# EAGLE design lc3dimmer_common_gnd (EAGLE 5.04)
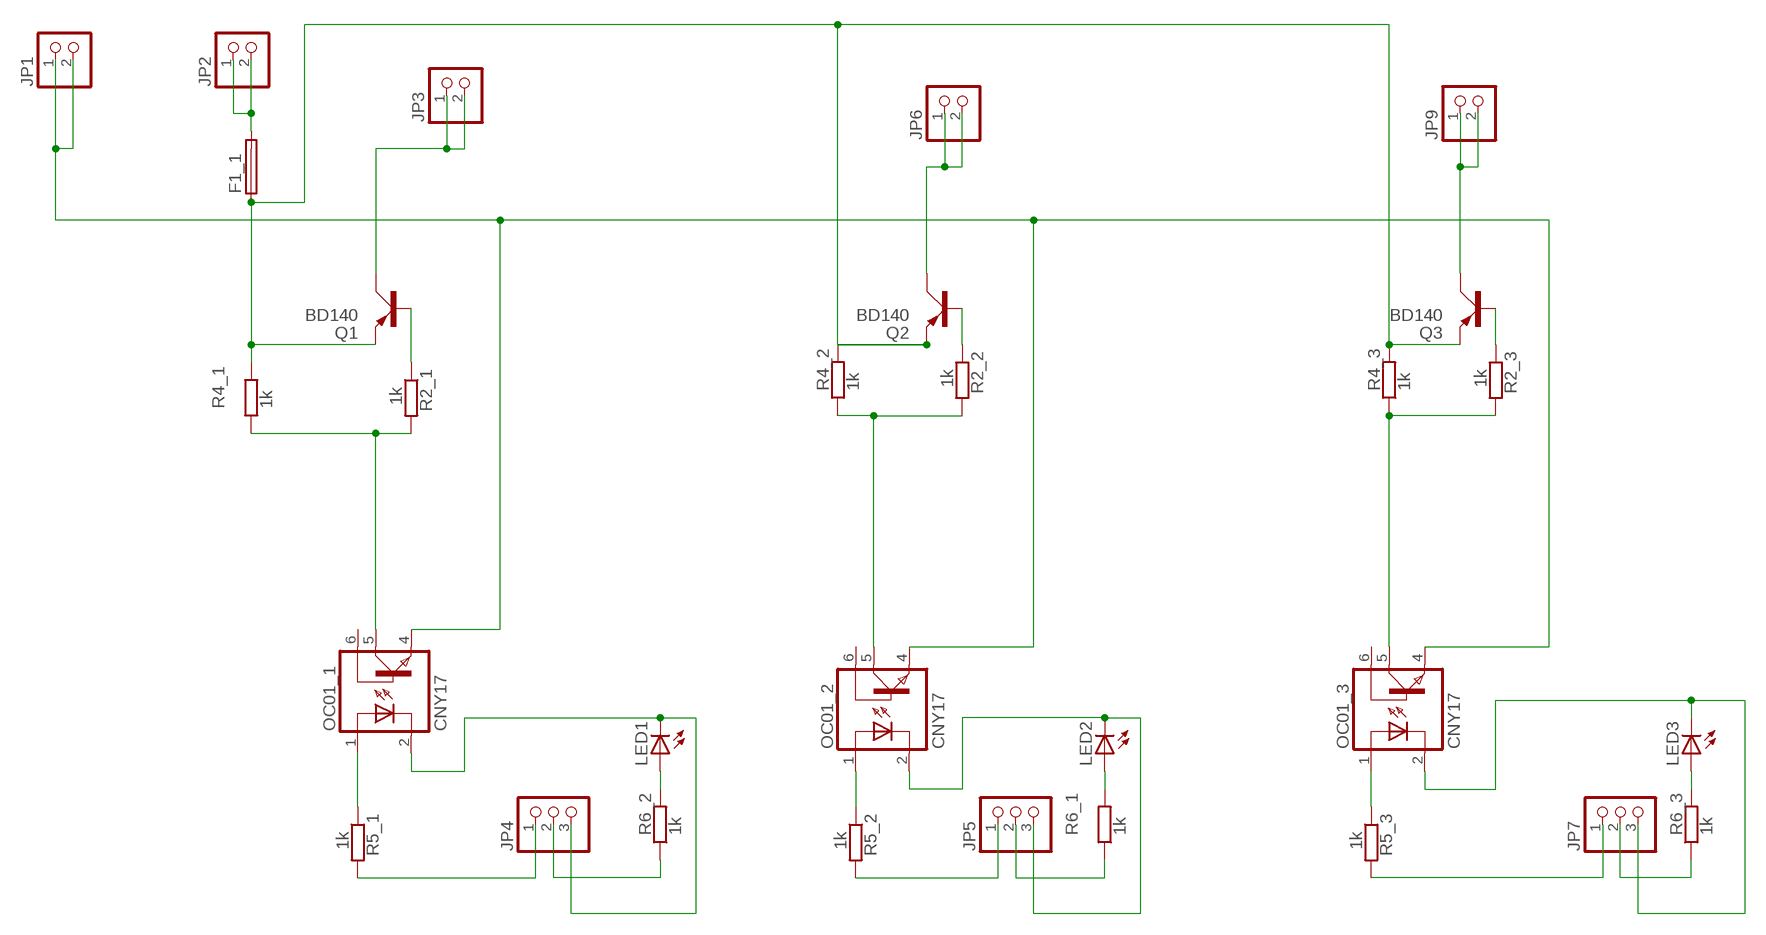
[diagram p0: schematic, sheet 1]

## Parts
F1_1  F457REICHELT  [PTF50]
JP1  PINHD-1X2  [1X02]
JP2  PINHD-1X2  [1X02]
JP3  PINHD-1X2  [1X02]
JP4  PINHD-1X3  [1X03]
JP5  PINHD-1X3  [1X03]
JP6  PINHD-1X2  [1X02]
JP7  PINHD-1X3  [1X03]
JP9  PINHD-1X2  [1X02]
LED1  LED3MM  [LED3MM]
LED2  LED3MM  [LED3MM]
LED3  LED3MM  [LED3MM]
OC01_1  CNY17  [DIL06]
OC01_2  CNY17  [DIL06]
OC01_3  CNY17  [DIL06]
Q1  BD140  [TO126AV]
Q2  BD140  [TO126AV]
Q3  BD140  [TO126AV]
R2_1  1k  R-EU_0207/10  [0207/10]
R2_2  1k  R-EU_0207/10  [0207/10]
R2_3  1k  R-EU_0207/10  [0207/10]
R4_1  1k  R-EU_0207/10  [0207/10]
R4_2  1k  R-EU_0207/10  [0207/10]
R4_3  1k  R-EU_0207/10  [0207/10]
R5_1  1k  R-EU_R1206  [R1206]
R5_2  1k  R-EU_R1206  [R1206]
R5_3  1k  R-EU_R1206  [R1206]
R6_1  1k  R-EU_R1206  [R1206]
R6_2  1k  R-EU_R1206  [R1206]
R6_3  1k  R-EU_R1206  [R1206]

## Nets
12V+: F1_1.2 JP2.1 JP2.2
DIMMGND: JP3.1 JP3.2 Q1.C
GND: JP7.3 LED3.K(C) OC01_3.2(C)
LED+: F1_1.1 Q1.E Q2.E Q3.E R4_1.2 R4_2.2 R4_3.2
LED-: JP1.1 JP1.2 OC01_1.4(EMI) OC01_2.4(EMI) OC01_3.4(EMI)
N$2: OC01_2.5(COL) R2_2.2 R4_2.1
N$3: OC01_1.5(COL) R2_1.2 R4_1.1
N$4: OC01_2.1(A) R5_2.1
N$5: Q1.B R2_1.1
N$6: Q2.B R2_2.1
N$7: OC01_3.5(COL) R2_3.2 R4_3.1
N$8: Q3.B R2_3.1
N$12: JP6.1 JP6.2 Q2.C
N$14: OC01_3.1(A) R5_3.1
N$23: JP9.1 JP9.2 Q3.C
N$24: LED1.A R6_2.2
N$25: LED2.A R6_1.2
N$26: JP4.2 R6_2.1
N$27: LED3.A R6_3.2
N$28: JP4.1 R5_1.2
N$29: JP5.1 R5_2.2
N$30: JP7.2 R6_3.1
N$31: JP5.3 LED2.K(C) OC01_2.2(C)
N$32: JP5.2 R6_1.1
N$33: JP7.1 R5_3.2
N$34: JP4.3 LED1.K(C) OC01_1.2(C)
N$37: OC01_1.1(A) R5_1.1
Unconnected: OC01_1.6(BAS) OC01_2.6(BAS) OC01_3.6(BAS)

## Library data of the parts
F1_1 = fuse:F457: FUSE HOLDER CS, Schukat
JP1-JP3 JP6 JP9 = pinhead:PINHD-1X2: PIN HEADER
JP4 JP5 JP7 = pinhead:PINHD-1X3: PIN HEADER
LED1-LED3 = led:LED: LED OSRAM: - CHIPLED LG R971, LG N971, LY N971, LG Q971, LY Q971, LO R971, LY R971 LH N974, LH R974 LS Q976, LO Q976, LY Q976 LO Q996 - Hyper CHIPLED LW Q18S LB Q993, LB Q99A, LB R99A - SideLED LS A670, LO A670, LY A670, LG A670, LP A670 LB A673, LV A673, LT A673, LW A673 LH A674 LY A675 LS A676, LA A676, LO A676, LY A676, LW A676 LS A679, LY A679, LG A679 - Hyper Micro SIDELED® LS Y876, LA Y876, LO Y876, LY Y876 LT Y87S - SmartLED LW L88C, LW L88S LB L89C, LB L89S, LG L890 LS L89K, LO L89K, LY L89K LS L896, LA L896, LO L896, LY L896 - TOPLED LS T670, LO T670, LY T670, LG T670, LP T670 LSG T670, LSP T670, LSY T670, LOP T670, LYG T670 LG T671, LOG T671, LSG T671 LB T673, LV T673, LT T673, LW T673 LH T674 LS T676, LA T676, LO T676, LY T676, LB T676, LH T676, LSB T676, LW T676 LB T67C, LV T67C, LT T67C, LS T67K, LO T67K, LY T67K, LW E67C LS E67B, LA E67B, LO E67B, LY E67B, LB E67C, LV E67C, LT E67C LW T67C LS T679, LY T679, LG T679 LS T770, LO T770, LY T770, LG T770, LP T770 LB T773, LV T773, LT T773, LW T773 LH T774 LS E675, LA E675, LY E675, LS T675 LS T776, LA T776, LO T776, LY T776, LB T776 LHGB T686 LT T68C, LB T68C - Hyper Mini TOPLED® LB M676 - Mini TOPLED Santana® LG M470 LS M47K, LO M47K, LY M47K Source: http://www.osram.convergy.de - LUMILED® LXK2-PW12-R00, LXK2-PW12-S00, LXK2-PW14-U00, LXK2-PW14-V00 LXK2-PM12-R00, LXK2-PM12-S00, LXK2-PM14-U00 LXK2-PE12-Q00, LXK2-PE12-R00, LXK2-PE12-S00, LXK2-PE14-T00, LXK2-PE14-U00 LXK2-PB12-K00, LXK2-PB12-L00, LXK2-PB12-M00, LXK2-PB14-N00, LXK2-PB14-P00, LXK2-PB14-Q00 LXK2-PR12-L00, LXK2-PR12-M00, LXK2-PR14-Q00, LXK2-PR14-R00 LXK2-PD12-Q00, LXK2-PD12-R00, LXK2-PD12-S00 LXK2-PH12-R00, LXK2-PH12-S00 LXK2-PL12-P00, LXK2-PL12-Q00, LXK2-PL12-R00 Source: www.luxeon.com
OC01_1-OC01_3 = optocoupler:CNY17: SIEMENS OPTO COUPLER
Q1-Q3 = transistor-power:BD140: PNP TRANSISTOR
R2_1-R2_3 R4_1-R4_3 R5_1-R5_3 R6_1-R6_3 = rcl:R-EU_: RESISTOR, European symbol

## Board
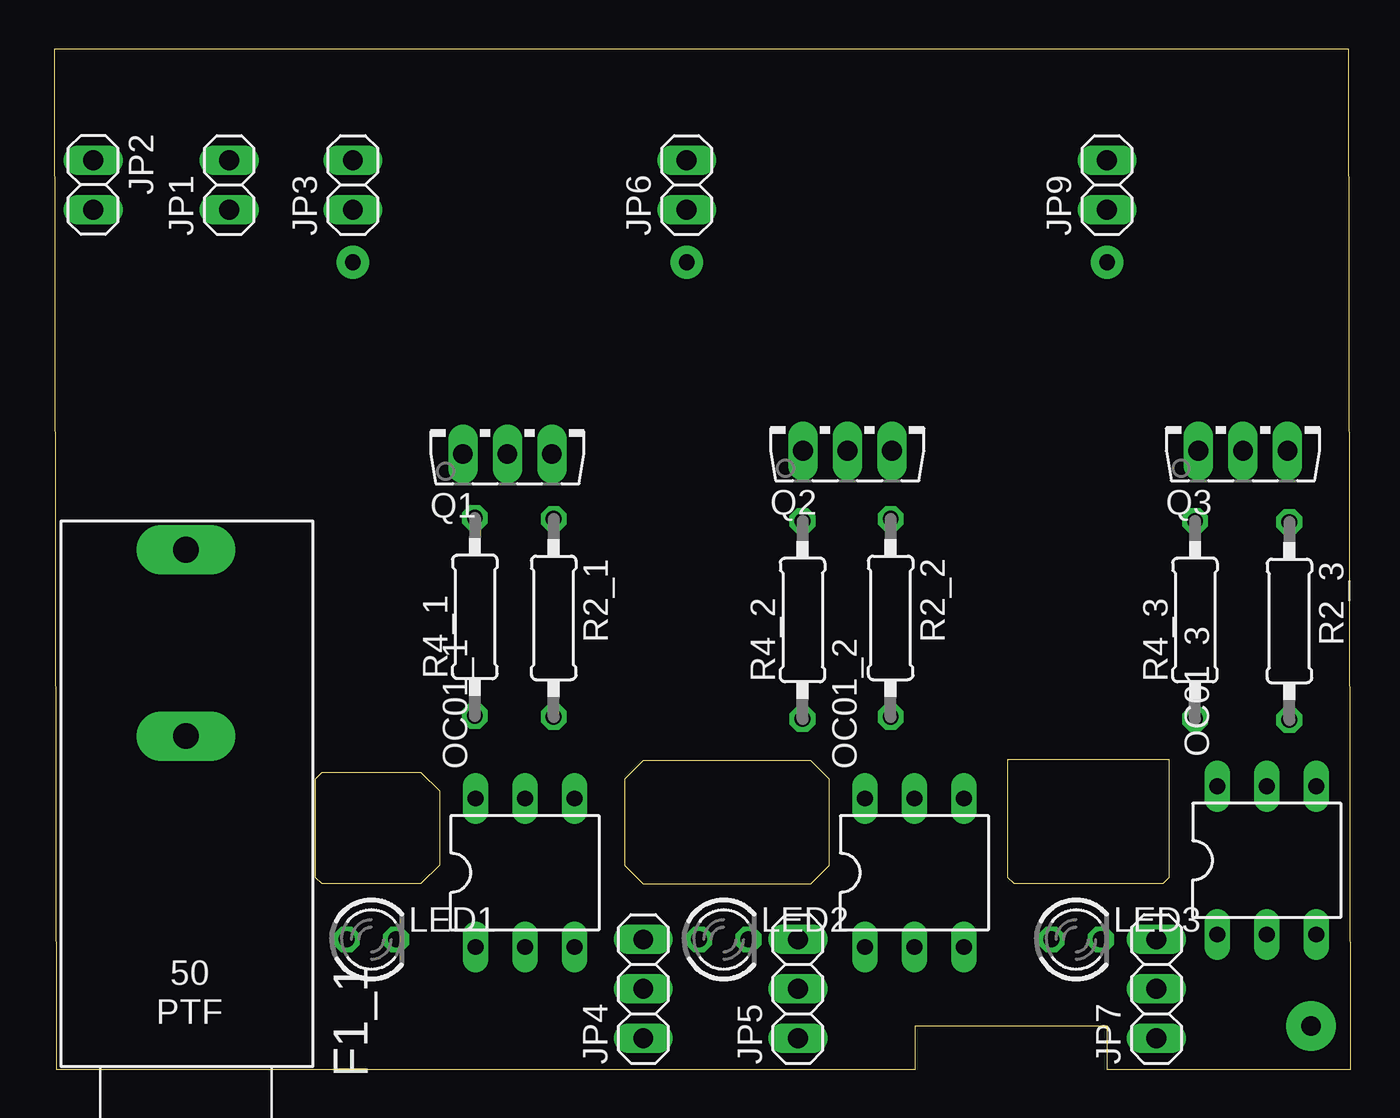
[diagram p1: board, top side]
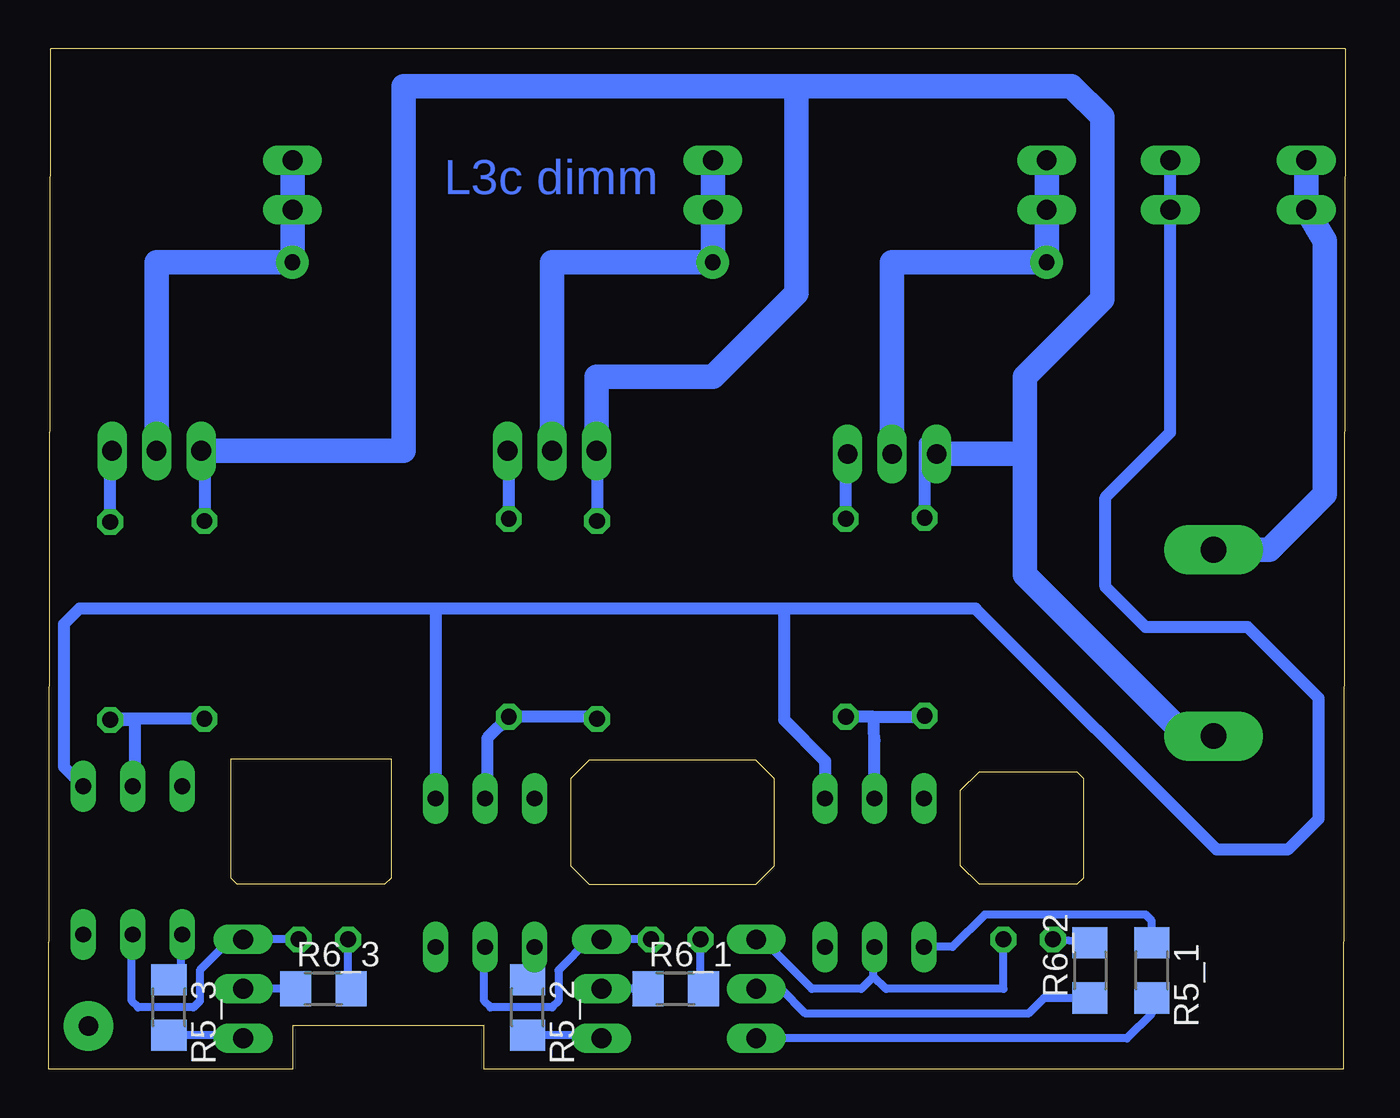
[diagram p2: board, bottom side, seen from below]

Size 66.6 x 52.4 mm. Coordinates in mm from the lower left corner, seen from the top.
Outline: 0.1,0 44.23,0 44.23,2.22 54.08,2.22 54.08,0 66.6,0 66.5,52.4 0,52.4 0.1,0
Outline: 49,9.84 49,15.91 57.25,15.91 57.25,9.84 56.93,9.53 49.31,9.53 49,9.84
Outline: 29.31,14.92 30.26,15.88 38.84,15.88 39.79,14.92 39.79,10.44 38.84,9.49 30.26,9.49 29.31,10.44 29.31,14.92
Outline: 13.75,15.24 18.83,15.24 19.79,14.29 19.79,10.48 18.83,9.53 13.75,9.53 13.44,9.84 13.44,14.92 13.75,15.24
Copper layers (1*16): Top 0.035mm / dielectric 1.5mm / Bottom 0.035mm
Design rules "default": minimum track width 10mil, minimum drill 24mil, track to track 8mil, track to pad 8mil, pad to pad 8mil, via to via 8mil, smd to smd 8mil, copper to edge 40mil, drill to drill 8mil, minimum pad ring 10mil, minimum via ring 8mil, stop-mask expansion 4mil, vias tented up to drill 0mil, thermal gap 10mil
tKeepout: area 0.1,60.8 to 66.8,62.4; area 43,62.5 to 49.2,73.3; area 26.1,62.4 to 37.4,65.2; area 16,62.5 to 25.5,75.4
bRestrict: area 4,37.4 to 7,40.4

### Footprints (pad centres in the part's own frame; a part is rotated, then mirrored left to right if it is on the bottom)
PTF50 = drill 1.321 pad 2.54 long: 1 -4.48,0; 2 5.08,0
1X02 = drill 1.016 long: 1 -1.27,0; 2 1.27,0
1X03 = drill 1.016 long: 1 -2.54,0; 2 0,0; 3 2.54,0
LED3MM = drill 0.813 octagon: A -1.27,0; K 1.27,0
DIL06 = drill 0.813 long: 1 -2.54,-3.81; 2 0,-3.81; 3 2.54,-3.81; 4 2.54,3.81; 5 0,3.81; 6 -2.54,3.81
TO126AV = drill 1.016 long: B 2.286,-1.27; C 0,-1.27; E -2.286,-1.27
0207/10 = drill 0.813 octagon: 1 -5.08,0; 2 5.08,0
R1206 = smd 1.6 x 1.803: 1 -1.422,0; 2 1.422,0

### Placement (x,y rotation side)
F1_1  6.77,21.59 90 top
JP1  8.99,45.4 90 top
JP2  2,45.4 270 top
JP3  15.34,45.4 90 top
JP4  30.26,4.13 90 top
JP5  38.2,4.13 90 top
JP6  32.48,45.4 90 top
JP7  56.62,4.13 90 top
JP9  54.08,45.4 90 top
LED1  16.29,6.67 0 top
LED2  34.39,6.67 0 top
LED3  52.49,6.67 0 top
OC01_1  24.18,10.09 0 top
OC01_2  44.19,10.09 0 top
OC01_3  62.28,10.73 0 top
Q1  23.28,32.86 0 top
Q2  40.74,33.02 0 top
Q3  61.06,33.02 0 top
R2_1  25.66,23.18 270 top
R2_2  42.96,23.18 270 top
R2_3  63.44,23.02 270 top
R4_1  21.61,23.23 90 top
R4_2  38.44,23.07 90 top
R4_3  58.6,23.07 90 top
R5_1  9.94,5.08 270 bottom
R5_2  42.01,3.17 270 bottom
R5_3  60.43,3.17 270 bottom
R6_1  34.39,4.13 0 bottom
R6_2  13.12,5.08 90 bottom
R6_3  52.49,4.13 0 bottom

### Tracks (layer width: path | path; a pad name or v marks a point on that pad's centre or on a via)
12V+
  Bottom 1.27: F1_1.2 3.91,26.67 1.05,29.53 1.05,42.55 JP2.2 JP2.1
DIMMGND  (via drill 0.8 pad 1.68)
  Bottom 1.27: JP3.2 JP3.1 v15.34,41.43 23.28,41.43 Q1.C
GND
  Bottom 0.406: LED3.K JP7.3 57.25,6.67 58.84,5.08 58.84,3.49 59.16,3.17 62.01,3.17 62.33,3.49 62.33,6.23 OC01_3.2
LED+
  Bottom 0.61: R4_1.2 21.61,32.15 21.05,32.7 21.05,31.84 Q1.E | R4_2.2 38.44,34.85 38.36,34.92 38.36,35.47 Q2.E | R4_3.2 58.6,31.57 Q3.E
  Bottom 1.27: Q3.E 48.36,31.75 48.36,50.48 28.2,50.48 28.2,50.32 | 28.2,50.32 28.2,39.85 | 28.2,39.85 | 28.2,39.85 32.48,35.56 38.45,35.56 Q2.E | 16.45,31.59 16.45,35.56 12.48,39.53 12.48,48.9 14.07,50.48 28.04,50.48 28.2,50.32 | 16.45,31.59 Q1.E | F1_1.1 8.16,17.11 16.45,25.4 16.45,31.59 | 16.45,31.91 16.45,31.59
LED-
  Bottom 0.61: 9.15,46.67 JP1.2 JP1.1 8.99,32.7 12.32,29.37 12.32,24.77 10.26,22.7 5.02,22.7 1.37,19.05 1.37,12.86 2.96,11.27 6.61,11.27 18.99,23.65 28.99,23.65 | 26.61,13.79 OC01_1.4 26.72,15.83 28.83,17.94 28.83,23.5 28.99,23.65 | 28.99,23.65 46.61,23.65 | 46.61,23.65 65.03,23.65 65.82,22.86 65.82,15.54 OC01_3.4 | OC01_2.4 46.73,23.54 46.61,23.65
N$2
  Bottom 0.61: R4_2.1 38.65,18.1 R2_2.2 44.07,16.99 44.07,14.01 OC01_2.5
N$3
  Bottom 0.61: 24.23,18.1 21.82,18.1 R4_1.1 | 24.23,18.1 R2_1.2 | OC01_1.5 24.18,16.88 24.23,18.1
N$4
  Bottom 0.406: OC01_2.1 41.65,4.96 R5_2.1
N$5
  Bottom 0.61: R2_1.1 25.66,31.81 Q1.B
N$6
  Bottom 0.61: R2_2.1 42.96,31.66 Q2.B
N$7
  Bottom 0.61: R4_3.1 63.33,17.99 R2_3.2 | R2_3.2 | R2_3.2 62.17,17.94 62.17,14.65 OC01_3.5
N$8
  Bottom 0.61: R2_3.1 63.44,31.81 Q3.B
N$12  (via drill 0.8 pad 1.68)
  Bottom 1.27: JP6.2 JP6.1 v32.48,41.43 40.74,41.43 Q2.C
N$14
  Bottom 0.406: R5_3.1 59.79,5.28 OC01_3.1
N$17  (via drill 1 pad 2.54)
  other vias: 64.55,2.22
N$23  (via drill 0.8 pad 1.68)
  Bottom 1.27: JP9.2 JP9.1 v54.08,41.43 61.06,41.43 Q3.C
N$24
  Bottom 0.406: R6_2.2 LED1.A
N$25
  Bottom 0.406: LED2.A 33.12,4.28 R6_1.2
N$26
  Bottom 0.406: R6_2.1 15.49,3.66 16.29,2.86 27.72,2.86 28.99,4.13 JP4.2
N$27
  Bottom 0.406: LED3.A 51.22,4.28 R6_3.2
N$28
  Bottom 0.406: R5_1.2 9.94,2.86 11.21,1.59 JP4.1
N$29
  Bottom 0.406: R5_2.2 38.99,1.75 JP5.1
N$30
  Bottom 0.406: R6_3.1 JP7.2
N$31
  Bottom 0.406: LED2.K JP5.3 38.84,6.67 40.42,5.08 40.42,3.49 40.74,3.17 43.91,3.17 44.23,3.49 44.23,5.6 OC01_2.2
N$32
  Bottom 0.406: 35.81,3.66 R6_1.1 JP5.2
N$33
  Bottom 0.406: R5_3.2 57.08,1.75 JP7.1
N$34
  Bottom 0.406: LED1.K 17.56,4.13 23.6,4.13 24.23,4.76 | 24.23,4.76 24.23,6.23 OC01_1.2 | JP4.3 29.95,6.67 27.41,4.13 24.87,4.13 24.23,4.76
N$37
  Bottom 0.406: OC01_1.1 20.17,6.28 18.52,7.94 10.26,7.94 9.94,7.62 R5_1.1

### Text on the board
Bottom: L3c dimm